# Altium schematic sheet RF_RECEIVER_Schematic.SchDoc
size A4; SheetNumber: 1; SheetTotal: 1
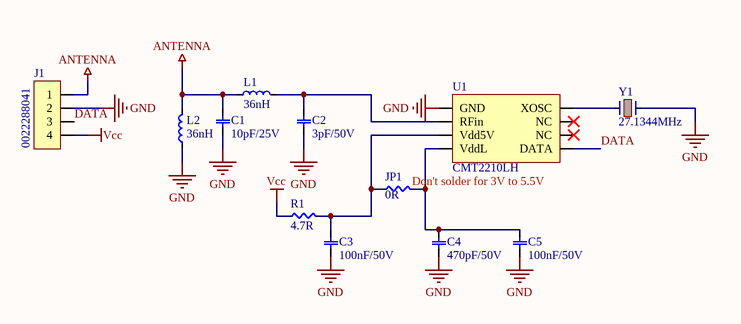
[diagram p0: RF_RECEIVER_Schematic.SchDoc]

## Parts
C1  10pF/25V  [Cap_0805]
C2  3pF/50V  [Cap_0805]
C3  100nF/50V  [Cap_0805]
C4  470pF/50V  [Cap_0805]
C5  100nF/50V  [Cap_0805]
J1  0022288041  [HDR_MALE_1x4_100mil_90DRC]
JP1  0R  [R_0805]
L1  36nH  [FERRITEBEAD_0805]
L2  36nH  [FERRITEBEAD_0805]
R1  4.7R  [R_0805]
U1  CMT2210LH  [SOP8]
Y1  27.1344MHz  [CRYSTAL_SMD_DIP]

## Nets
ANTENNA: C1.2 J1.1 L1.1 L2.2
GND: C1.1 C2.1 C3.1 C4.1 C5.1 J1.2 L2.1 U1.1(GND) Y1.2
Vcc: J1.4 R1.1
DATA: J1.3 U1.5(DATA)
NetC2_2: C2.2 L1.2 U1.2(RFin)
NetC3_2: C3.2 JP1.1 R1.2 U1.3(Vdd5V)
NetC4_2: C4.2 C5.2 JP1.2 U1.4(VddL)
NetU1_8: U1.8(XOSC) Y1.1

Not connected (* = marked no-connect by the designer): U1 6(NC)* 7(NC)*

## Notes on the sheet
- (near JP1) Don't solder for 3V to 5.5V

## Library data of the parts
C1 = C0805C100J3GAC7800: CAP CER pF 10 25V NP0 0805; Manufacturer: KEMET; Dielectric Material: Ceramic; Capacitance: 10pF; Tolerance: 5%; Dielectric: C0G; Supplier 1: Digi-Key; Manufacturer Part Number: C0805C100J3GAC7800; RoHS: Yes; Category: Ceramic Capacitors; Stock 1: 7973; Pricing 1: 1=0,24000, 10=0,16500, 50=0,11000, 100=0,09350, 500=0,06600, 1000=0,05775 (USD); Mount: Surface Mount; Case/Package: 0805; Case Code (Imperial): 0805; Case Code (Metric): 2012; Min Operating Temperature: -55°C; Max Operating Temperature: 125°C; Packaging: Tape and Reel; Voltage Rating (DC): 25V; Series: SMD Comm C0G; Voltage Rating: 25V; Construction: Flat; Length: 2mm; Height: 0.78mm; Depth: 1.25mm; Radiation Hardening: No; Lead Free: Lead Free; ComponentLink1URL: http://components.arrow.com/part/dataview/0323_00326663?src-supplier=Arrow+Europe; ComponentLink1Description: http://components.arrow.com/part/dataview/0323_00326663?src-supplier=Arrow+Europe; ComponentLink2URL: https://api.kemet.com/component-edge/download/datasheet/C0805C100J3GACTU.pdf?src-supplier=Digi-Key; ComponentLink2Description: https://api.kemet.com/component-edge/download/datasheet/C0805C100J3GACTU.pdf?src-supplier=Digi-Key; ComponentLink3URL: https://search.kemet.com/component-edge/download/datasheet/C0805C100J3GACTU.pdf?src-supplier=Digi-Key; ComponentLink3Description: https://search.kemet.com/component-edge/download/datasheet/C0805C100J3GACTU.pdf?src-supplier=Digi-Key; ComponentLink4URL: http://capacitoredge.kemet.com/capedge2/DataSheet?pn=C0805C100J3GACTU&src-supplier=Avnet; ComponentLink4Description: http://capacitoredge.kemet.com/capedge2/DataSheet?pn=C0805C100J3GACTU&src-supplier=Avnet; ComponentLink5URL: http://capacitoredge.kemet.com/capedge2/DataSheet?pn=C0805C100J3GACTU&src-supplier=Avnet+Europe; ComponentLink5Description: http://capacitoredge.kemet.com/capedge2/DataSheet?pn=C0805C100J3GACTU&src-supplier=Avnet+Europe; Supplier Part Number 1: 399-14542-1-ND
C2 = CC0805CRNPO9BN3R0: CAP CER pF 3 50V C0G/NPO 0805; Manufacturer: Yageo; Capacitance: 3pF; Dielectric: C0G; Supplier 1: Digi-Key; Manufacturer Part Number: CC0805CRNPO9BN3R0; RoHS: Yes; Category: Ceramic Capacitors; Stock 1: 4733; Pricing 1: 1=0,12000, 10=0,08400, 50=0,04740, 100=0,03930, 500=0,02754, 1000=0,02280 (USD); Mount: Surface Mount; Case/Package: 0805; Case Code (Imperial): 0805; Case Code (Metric): 2012; Weight: 0.000194oz; Min Operating Temperature: -55°C; Max Operating Temperature: 125°C; Packaging: Tape and Reel; Voltage Rating: 50V; Voltage Rating (DC): 50V; Package Quantity: 4000; Termination: SMD/SMT; Resistor Type: Ceramic; Length: 2mm; Width: 1.25mm; Thickness: 0.024inch; Depth: 1.25mm; Radiation Hardening: No; Lead Free: Lead Free; ComponentLink1URL: https://datasheet.ciiva.com/145/mlccorderingcode-145639.pdf?src-supplier=Digi-Key; ComponentLink1Description: https://datasheet.ciiva.com/145/mlccorderingcode-145639.pdf?src-supplier=Digi-Key; ComponentLink2URL: https://datasheet.ciiva.com/145/mlccorderingcode-145640.pdf?src-supplier=Digi-Key; ComponentLink2Description: https://datasheet.ciiva.com/145/mlccorderingcode-145640.pdf?src-supplier=Digi-Key; ComponentLink3URL: https://datasheet.ciiva.com/145/mlccorderingcode-145641.pdf?src-supplier=Digi-Key; ComponentLink3Description: https://datasheet.ciiva.com/145/mlccorderingcode-145641.pdf?src-supplier=Digi-Key; ComponentLink4URL: https://datasheet.ciiva.com/17436/upy-gp-np0-16v-to-50v-8-17436766.pdf?src-supplier=Avnet+Europe; ComponentLink4Description: https://datasheet.ciiva.com/17436/upy-gp-np0-16v-to-50v-8-17436766.pdf?src-supplier=Avnet+Europe; Supplier Part Number 1: 311-1092-1-ND
C3 C5 = C2012X7R1H104K125AE: CAP CER nF 100 50V X7R 0805; Manufacturer: TDK Corporation; Tolerance: ±10%; Supplier 1: Digi-Key; Manufacturer Part Number: C2012X7R1H104K125AE; RoHS: RoHS Compliant; Category: Capacitors; Stock 1: 21863; Pricing 1: 1=0.29, 10=0.197, 100=0.1118, 500=0.07894, 1000=0.06907 (USD); Packaging: Cut Tape (CT); Part Status: Active; Voltage - Rated: 50V; Temperature Coefficient: X7R; Operating Temperature: -55°C ~ 125°C; Features: Soft Termination; Ratings: -; Applications: Boardflex Sensitive; Failure Rate: -; Mounting Type: Surface Mount, MLCC; Package / Case: 0805 (2012 Metric); Size / Dimension: 0.079" L x 0.049" W (2.00mm x 1.25mm); Height - Seated (Max): -; Thickness (Max): 0.057" (1.45mm); Lead Spacing: -; Lead Style: -; ComponentLink1URL: https://product.tdk.com/info/en/catalog/datasheets/mlcc_commercial_soft_en.pdf; ComponentLink1Description: https://product.tdk.com/info/en/catalog/datasheets/mlcc_commercial_soft_en.pdf; Supplier Part Number 1: 445-15929-1-ND
C4 = CC0805JRNPO9BN471: CAP CER pF 470 50V C0G/NPO 0805; Manufacturer 1: Yageo; Description 1: CAP CER 470PF 50V C0G/NPO 0805; Material: Ceramic; Capacitance: 470pF; Tolerance: 5%; Dielectric: C0G; Temperature Coefficient: 30ppm/°C; Insulation Resistance: 100GR; Supplier 1: Digi-Key; Manufacturer Part Number 1: CC0805JRNPO9BN471; Stock 1: 322742; Pricing 1: 1=0.13, 10=0.095, 100=0.0448, 500=0.03144, 1000=0.02603 (USD); Mount: Surface Mount; Case/Package: 0805; Case Code (Metric): 2012; Case Code (Imperial): 0805; Dielectric Material: Ceramic; Min Operating Temperature: -55°C; Max Operating Temperature: 125°C; Voltage Rating: 50V; Voltage Rating (DC): 50V; Package Quantity: 4000; Packaging: Tape and Reel; Termination: SMD/SMT; Composition: Ceramic; Voltage: 50V; Length: 2mm; Height: 0.6mm; Width: 0.049inch; Thickness: 0.024inch; Depth: 1.25mm; Radiation Hardening: No; REACH SVHC: Unknown; Lead Free: Lead Free; ComponentLink1URL: http://www.farnell.com/datasheets/2213336.pdf?src-supplier=Newark; ComponentLink1Description: http://www.farnell.com/datasheets/2213336.pdf?src-supplier=Newark; ComponentLink2URL: http://www.yageo.com/documents/recent/UPY-GP_NP0_16V-to-50V_16.pdf?src-supplier=Digi-Key; ComponentLink2Description: http://www.yageo.com/documents/recent/UPY-GP_NP0_16V-to-50V_16.pdf?src-supplier=Digi-Key; ComponentLink3URL: http://www.farnell.com/datasheets/1443161.pdf?src-supplier=Element14; ComponentLink3Description: http://www.farnell.com/datasheets/1443161.pdf?src-supplier=Element14; ComponentLink4URL: http://documents.rs-components.com/techlib://itc_doclist_GB.htm?stockno=6698928&src-supplier=RSComponents; ComponentLink4Description: http://documents.rs-components.com/techlib://itc_doclist_GB.htm?stockno=6698928&src-supplier=RSComponents; ComponentLink5URL: http://www.yageo.com/documents/recent/UPY-GP_NP0_16V-to-50V_8.pdf?src-supplier=Avnet+Europe; ComponentLink5Description: http://www.yageo.com/documents/recent/UPY-GP_NP0_16V-to-50V_8.pdf?src-supplier=Avnet+Europe; ComponentLink6URL: http://www.farnell.com/datasheets/2213336.pdf?src-supplier=Element14; ComponentLink6Description: http://www.farnell.com/datasheets/2213336.pdf?src-supplier=Element14; Supplier Part Number 1: 311-1119-6-ND
J1 = 0022288041: CONN HEADER 4POS R/A 2.54MM; Manufacturer: Molex; Gender: Male; Voltage Rating (DC): 250V; Number of Circuits: 4; Current Rating: 4A; Connector Type: Male Pin; Pitch: 0.1inch; Glow Wire Compliant: Non-compliant; Supplier 1: Digi-Key; Manufacturer Part Number: 0022288041; Stock 1: 1112; Pricing 1: 1 = 0,34000, 10 = 0,32200, 25 = 0,27640, 50 = 0,23480, 100 = 0,22560, 250 = 0,20256, 500 = 0,19336 (USD); RoHS: Yes; Mount: Through Hole; Housing Color: Black; Color: Black; Contact Material: Brass; Contact Plating: Tin; Housing Material: Thermoplastic; Orientation: Right Angle; Number of Contacts: 4; Number of Positions: 4; Termination: Solder; Package Quantity: 1; Number of Rows: 1; Packaging: Bulk; Voltage Rating: 250V; Contact Mating Length: 0.324inch; Lead Free: Lead Free; Flammability Rating: UL94 V-0; ComponentLink1URL: https://datasheet.ciiva.com/10090/0022288041-pcb-headers-10090135.pdf?src-supplier=Avnet; ComponentLink1Description: https://datasheet.ciiva.com/10090/0022288041-pcb-headers-10090135.pdf?src-supplier=Avnet; ComponentLink2URL: https://datasheet.ciiva.com/6859/022288041-sd-6859126.pdf?src-supplier=Digi-Key; ComponentLink2Description: https://datasheet.ciiva.com/6859/022288041-sd-6859126.pdf?src-supplier=Digi-Key; Supplier Part Number 1: WM50025-04-ND
JP1 = RC0805JR-070RL: RES SMD 0 OHM JUMPER 1/8W 0805; Manufacturer: Yageo; Power (Watts): 0.125W, 1/8W; Supplier 1: Digi-Key; Manufacturer Part Number: RC0805JR-070RL; RoHS: RoHS Compliant; Category: Resistors; Stock 1: 5931980; Pricing 1: 1=0.1, 10=0.018, 25=0.0128, 50=0.0096, 100=0.0071, 250=0.00544, 500=0.00436, 1000=0.00321 (USD); Packaging: Cut Tape (CT); Part Status: Active; Tolerance: Jumper; Composition: Thick Film; Features: Moisture Resistant; Temperature Coefficient: -; Operating Temperature: -55°C ~ 155°C; Package / Case: 0805 (2012 Metric); Supplier Device Package: 0805; Size / Dimension: 0.079" L x 0.049" W (2.00mm x 1.25mm); Height - Seated (Max): 0.024" (0.60mm); Failure Rate: -; ComponentLink1URL: http://www.yageo.com/documents/recent/PYu-RC_Group_51_RoHS_L_8.pdf; ComponentLink1Description: http://www.yageo.com/documents/recent/PYu-RC_Group_51_RoHS_L_8.pdf; Supplier Part Number 1: 311-0.0ARCT-ND
L1 L2 = L-15W36NGV4E: FIXED IND 36NH 500MA SMD; Manufacturer: Johanson; Core Material: Ceramic; Tolerance: 2%; Shielding: Unshielded; Test Frequency: 100MHz; Supplier 1: Digi-Key; Manufacturer Part Number: L-15W36NGV4E; RoHS: Yes; Category: Fixed Inductors; Mount: Surface Mount; Case/Package: 0805; Min Operating Temperature: -40°C; Max Operating Temperature: 125°C; Package Quantity: 2000; Current Rating: 500mA; Packaging: Tape and Reel; Resistor Type: Wirewound; Inductance: 36nH; Length: 0.079inch; Width: 0.049inch; Height - Seated (Max): 0.055inch; ComponentLink1URL: https://www.johansontechnology.com/downloads/jti-cat-ww-ind.pdf?src-supplier=Digi-Key; ComponentLink1Description: https://www.johansontechnology.com/downloads/jti-cat-ww-ind.pdf?src-supplier=Digi-Key; Supplier Part Number 1: L-15W36NGV4E-ND
R1 = RC0805JR-074R7L: RES SMD 4.7 OHM 5% 1/8W 0805; Manufacturer: Yageo; Power Rating: 125mW; Voltage Rating: 150V; Temperature Coefficient: 200ppm/°C; Supplier 1: Digi-Key; Manufacturer Part Number: RC0805JR-074R7L; Stock 1: 128652; Pricing 1: 1 = 0,10000, 10 = 0,06200, 100 = 0,02510, 1000 = 0,01126, 2500 = 0,00978 (USD); RoHS: Yes; Case/Package: 0805; Case Code (Imperial): 0805; Case Code (Metric): 2012; Contact Plating: Tin,Lead,Matte; Min Operating Temperature: -55°C; Max Operating Temperature: 155°C; Resistance: 4.7R; Tolerance: 5%; Packaging: Tape and Reel; Termination: SMD/SMT; Resistor Type: Thick Film; Voltage Rating (DC): 150V; Length: 2mm; Depth: 1.25mm; Radiation Hardening: No; Lead Free: Lead Free; Military Standard: Not; ComponentLink1URL: https://datasheet.ciiva.com/12667/rc0805-12667432.pdf?src-supplier=Mouser; ComponentLink1Description: https://datasheet.ciiva.com/12667/rc0805-12667432.pdf?src-supplier=Mouser; ComponentLink2URL: https://datasheet.ciiva.com/16769/rc0805-16769871.pdf?src-supplier=Future+Electronics; ComponentLink2Description: https://datasheet.ciiva.com/16769/rc0805-16769871.pdf?src-supplier=Future+Electronics; Supplier Part Number 1: 311-4.7ARDKR-ND
U1 = CMT2210LH: IC RF RX ASK/OOK 300-960MHZ 8SOIC; ComponentLink1Description: Datasheet; ComponentLink1URL: https://www.hoperf.com/data/upload/portal/20190624/CMT2210LH-Datasheet-EN-V0.5-180822.pdf
Y1 = ECS-271.344-CDX-0383: CRYSTAL 27.1344MHZ 12PF SMD; Manufacturer: ECS International; Frequency Stability: 30ppm; Frequency Tolerance: 20ppm; ESR (Equivalent Series Resistance): 30R; Supplier 1: Digi-Key; Manufacturer Part Number: ECS-271.344-CDX-0383; Stock 1: 2; Pricing 1: 1 = 1,46000, 10 = 1,39800, 50 = 1,36500, 100 = 1,17000, 500 = 1,13750, 1000 = 0,95875, 2500 = 0,91000, 5000 = 0,87750, 10000 = 0,84500 (USD); RoHS: Yes; Mount: Surface Mount; Min Operating Temperature: -10°C; Max Operating Temperature: 70°C; Package Quantity: 1; Frequency: 27.1344MHz; Load Capacitance: 12pF; Packaging: Bulk; Length: 0.449inch; Height: 0.169inch; Width: 0.189inch; Lead Free: Lead Free; ComponentLink1URL: https://datasheet.ciiva.com/860/ecs-cdx-0370-386-860035.pdf?src-supplier=Digi-Key; ComponentLink1Description: https://datasheet.ciiva.com/860/ecs-cdx-0370-386-860035.pdf?src-supplier=Digi-Key; Supplier Part Number 1: XC1367-ND